# EAGLE design MySensors_AirQuality_Board_2017-11-26_i2c (EAGLE 8.3.2)
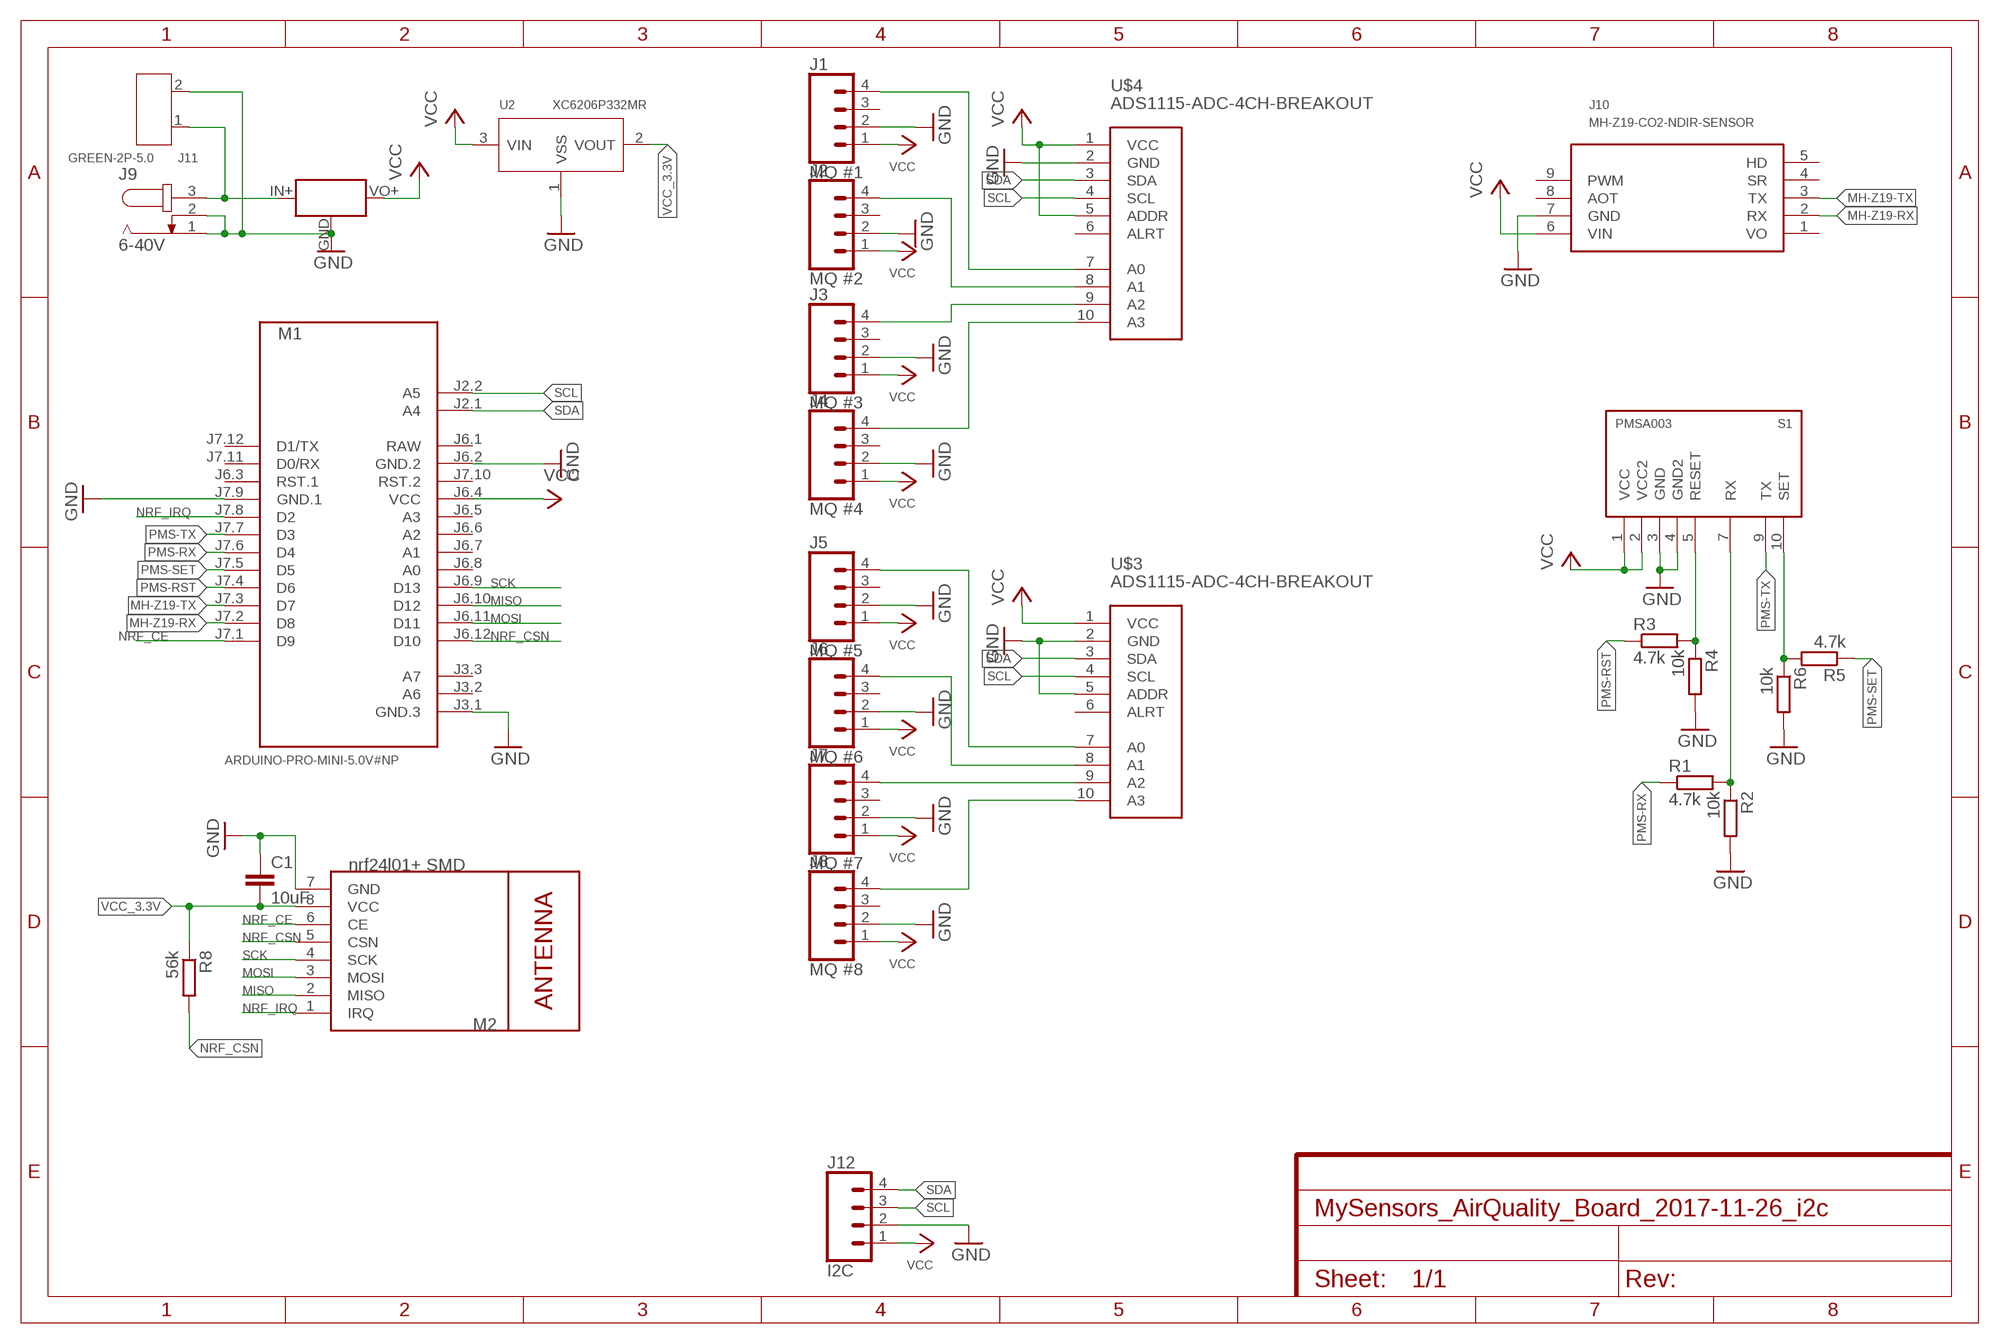
[diagram p0: schematic, sheet 1]
FRAME1 (FRAME-A4L): CNAME: MySensors AirQuality Board; CREVISION: 0.01; DESIGNER: R. Kainhofer, 2017-11-03

## Parts
C1  10uF  C-EUC0805  [C0805]
J1  MQ #1  CONN_04  [1X04]
J2  MQ #2  CONN_04  [1X04]
J3  MQ #3  CONN_04  [1X04]
J4  MQ #4  CONN_04  [1X04]
J5  MQ #5  CONN_04  [1X04]
J6  MQ #6  CONN_04  [1X04]
J7  MQ #7  CONN_04  [1X04]
J8  MQ #8  CONN_04  [1X04]
J9  6-40V  JACK-PLUG1  [SPC4078]
J10  MH-Z19-CO2-NDIR-SENSOR  [MH-Z19]
J11  GREEN-2P-5.0  SCREW-TERMINAL-GREEN(2P-5.0)  [H2-5.0-10.5X8.0MM]
J12  I2C  CONN_04  [1X04]
M1  ARDUINO-PRO-MINI-5.0V#NP  [ARDUINO-PRO-MINI#NP]
M2  nrf24l01+ SMD  WIRELESS-NRF24L01SMD  [WIRELESS-NRF24L01-SMD]
R1  4.7k  R-EU_R0805  [R0805]
R2  10k  R-EU_R0805  [R0805]
R3  4.7k  R-EU_R0805  [R0805]
R4  10k  R-EU_R0805  [R0805]
R5  4.7k  R-EU_R0805  [R0805]
R6  10k  R-EU_R0805  [R0805]
R8  56k  R-EU_R0805  [R0805]
S1  PMSA003  [PMSA003]
U2  XC6206P332MR  PMIC-LDO-XC6206P332MR-G(SOT23)  [SOT-23]
U$2  MINI_BUCK_CONVERTER  [MINI_BUCK_CONVERTER]
U$3  ADS1115-ADC-4CH-BREAKOUT  [ADS1115-ADC-4CH-BREAKOUT]
U$4  ADS1115-ADC-4CH-BREAKOUT  [ADS1115-ADC-4CH-BREAKOUT]

## Nets
A0: J1.4 U$4.7(A0)
A1: J2.4 U$4.8(A1)
A2: J3.4 U$4.9(A2)
A3: J4.4 U$4.10(A3)
GND: C1.1 J1.2 J2.2 J3.2 J4.2 J5.2 J6.2 J7.2 J8.2 J9.1 J9.2 J10.7(GND) J11.2 J12.2 M1.J3.1(GND.3) M1.J6.2(GND.2) M1.J7.9(GND.1) M2.7(GND) R2.2 R4.2 R6.2 S1.3(GND) S1.4(GND2) U2.1(VSS) U$2.GND U$3.2(GND) U$3.5(ADDR) U$4.2(GND)
MH-Z19-RX: J10.2(RX) M1.J7.2(D8)
MH-Z19-TX: J10.3(TX) M1.J7.3(D7)
MISO: M1.J6.10(D12) M2.2(MISO)
MOSI: M1.J6.11(D11) M2.3(MOSI)
N$1: J5.4 U$3.7(A0)
N$2: J9.3 J11.1 U$2.IN+(VIN)
N$3: J6.4 U$3.8(A1)
N$4: J7.4 U$3.9(A2)
N$5: J8.4 U$3.10(A3)
NRF_CE: M1.J7.1(D9) M2.6(CE)
NRF_CSN: M1.J6.12(D10) M2.5(CSN) R8.2
NRF_IRQ: M1.J7.8(D2) M2.1(IRQ)
PMS-RESET-3.3V: R3.2 R4.1 S1.5(RESET)
PMS-RST: M1.J7.4(D6) R3.1
PMS-RX: M1.J7.6(D4) R1.1
PMS-RX-3.3V: R1.2 R2.1 S1.7(RX)
PMS-SET: M1.J7.5(D5) R5.1
PMS-SET_3.3V: R5.2 R6.1 S1.10(SET)
PMS-TX: M1.J7.7(D3) S1.9(TX)
SCK: M1.J6.9(D13) M2.4(SCK)
SCL: J12.3 M1.J2.2(A5) U$3.4(SCL) U$4.4(SCL)
SDA: J12.4 M1.J2.1(A4) U$3.3(SDA) U$4.3(SDA)
VCC: J1.1 J2.1 J3.1 J4.1 J5.1 J6.1 J7.1 J8.1 J10.6(VIN) J12.1 M1.J6.4(VCC) S1.1(VCC) S1.2(VCC2) U2.3(VIN) U$2.VO+(VOUT) U$3.1(VCC) U$4.1(VCC) U$4.5(ADDR)
VCC_3.3V: C1.2 M2.8(VCC) R8.1 U2.2(VOUT)
Unconnected: J1.3 J2.3 J3.3 J4.3 J5.3 J6.3 J7.3 J8.3 J10.4(SR) J10.5(HD) J10.8(AOT) J10.9(PWM) M1.J3.2(A6) M1.J3.3(A7) M1.J6.3(RST.1) M1.J6.5(A3) M1.J6.6(A2) M1.J6.7(A1) M1.J6.8(A0) M1.J7.10(RST.2) M1.J7.11(D0/RX) M1.J7.12(D1/TX) U$3.6(ALRT) U$4.6(ALRT)

## Power pins joined to a net without a drawn wire
RAW: M1.J6.1(RAW)
VO: J10.1(VO)

## Library data of the parts
C1 = rcl:C-EU: CAPACITOR, European symbol
J1-J8 J12 = SparkFun-Connectors:CONN_04: Multi connection point. Often used as Generic Header-pin footprint for 0.1 inch spaced/style header connections On any of the 0.1 inch spaced packages, you can populate with these: Break Away Headers - Straight <https://www.sparkfun.com/products/116> (PRT-00116) Break Away Male Headers - Right Angle <https://www.sparkfun.com/products/553> (PRT-00553) Female Headers <https://www.sparkfun.com/products/115> (PRT-00115) Break Away Headers - Machine Pin <https://www.sparkfun.com/products/117> (PRT-00117) Break Away Female Headers - Swiss Machine Pin <https://www.sparkfun.com/products/743> (PRT-00743) For SCREWTERMINALS and SPRING TERMINALS visit here: Screw Terimnals on SparkFun.com <https://www.sparkfun.com/search/results?term=Screw+Terminals> (5mm/3.5mm/2.54mm spacing) This device is also useful as a general connection point to wire up your design to another part of your project. Our various solder wires solder well into these plated through hole pads. Hook-Up Wire - Assortment (Stranded, 22 AWG) <https://www.sparkfun.com/products/11375> (PRT-11375) Hook-Up Wire - Assortment (Solid Core, 22 AWG) <https://www.sparkfun.com/products/11367> (PRT-11367) View the entire wire category on our website here <https://www.sparkfun.com/categories/141> Special notes: Molex polarized connector foot print use with SKU : PRT-08231 with associated crimp pins and housings. 1MM SMD Version SKU: PRT-10208; PROD_ID: CONN-09696
J9 = con-jack:JACK-PLUG: DC POWER JACK Power Jack, DC, Right Angle, Through Hole, Rated 5A at 16VDC, PC Terminals Distributor: Farnell (www.Farnell.de) Drawing: 84N1161.pdf / 84N1162.pdf Manufacturer: SPC Technology (www.spctechnology.com) Type: SPC4077 / SPC 4078; OC_FARNELL: unknown; OC_NEWARK: unknown
J10 = opentools:MH-Z19: MH-Z19 - CO2 NDIR SENSOR
J11 = Seeed-Connector:SCREW-TERMINAL-GREEN(2P-5.0): 320110031
M1 = diy-modules:ARDUINO-PRO-MINI-*#NP: Arduino Pro Mini (and compatible devices) without programming pads More details available here: https://www.arduino.cc/en/Main/ArduinoBoardProMini Click here to find device on ebay.com <http://www.ebay.com/sch/arduino+pro+mini>
M2 = nrf24l01plus:WIRELESS-NRF24L01: 2.4 GHz Wireless Module based on NRF24L01 chip
R1-R6 = resistor:R-EU_: RESISTOR, European symbol
R8 = rcl:R-EU_: RESISTOR, European symbol
S1 = opentools:PMS: PLANTOWER PMSx003 Laser PM2.5 Dust Sensor
U2 = Seeed-IC:PMIC-LDO-XC6206P332MR-G(SOT23): 310030099; MPN: XC6206P332MR-G; VALUE: XC6206P332MR-G-SOT23
U$2 = opentools-sensors:MINI_BUCK_CONVERTER: 4.5-40V Step Down Buck Converter
U$3 U$4 = opentools:ADS1115-ADC-4CH-BREAKOUT: 4 Channel 16-Bit Analog-to-Digital Converter based on ADS1115 chip Arduino ADS1115 Getting Started Tutorial is available here: http://henrysbench.capnfatz.com/henrys-bench/arduino-voltage-measurements/arduino-ads1115-module-getting-started-tutorial/ ADS1115 datasheet is available here: http://www.ti.com/lit/ds/symlink/ads1115.pdf Click here to find device on ebay.com <http://www.ebay.com/sch/ads1115+module>

## Net classes
0 default: width 0.305 mm, clearance 0.203 mm

## Board
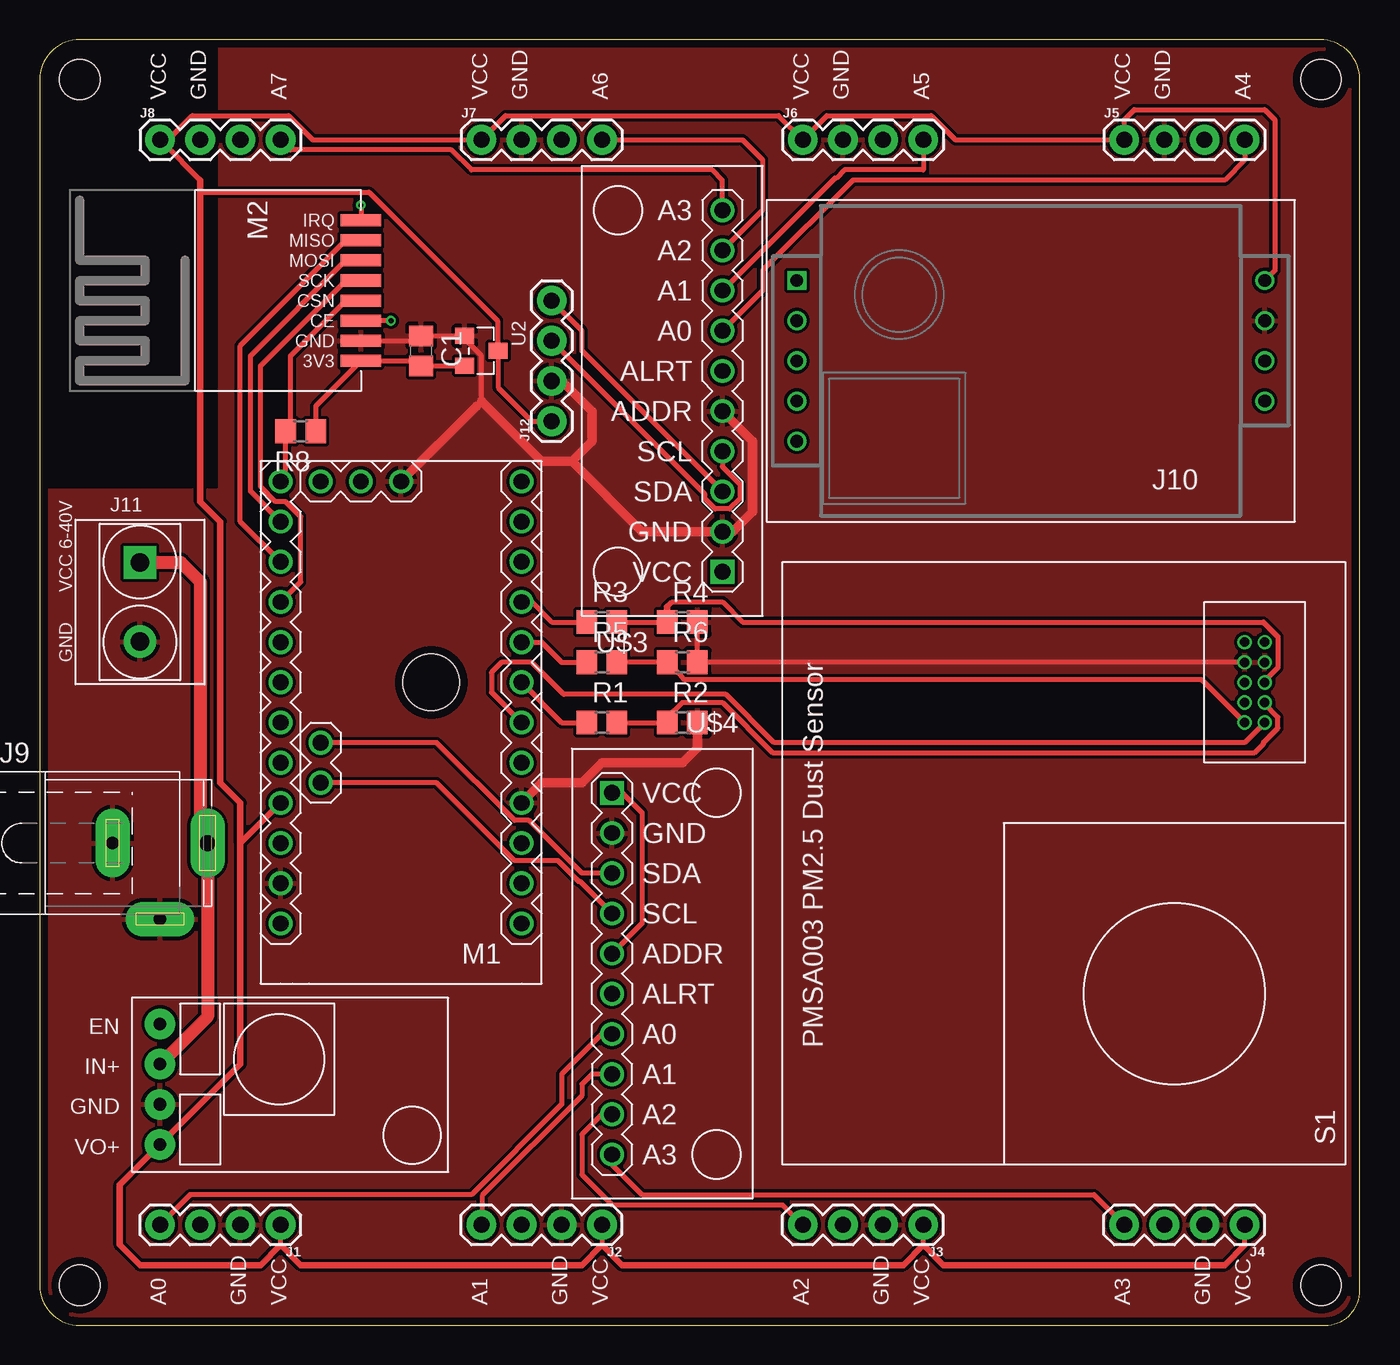
[diagram p1: board, top side]
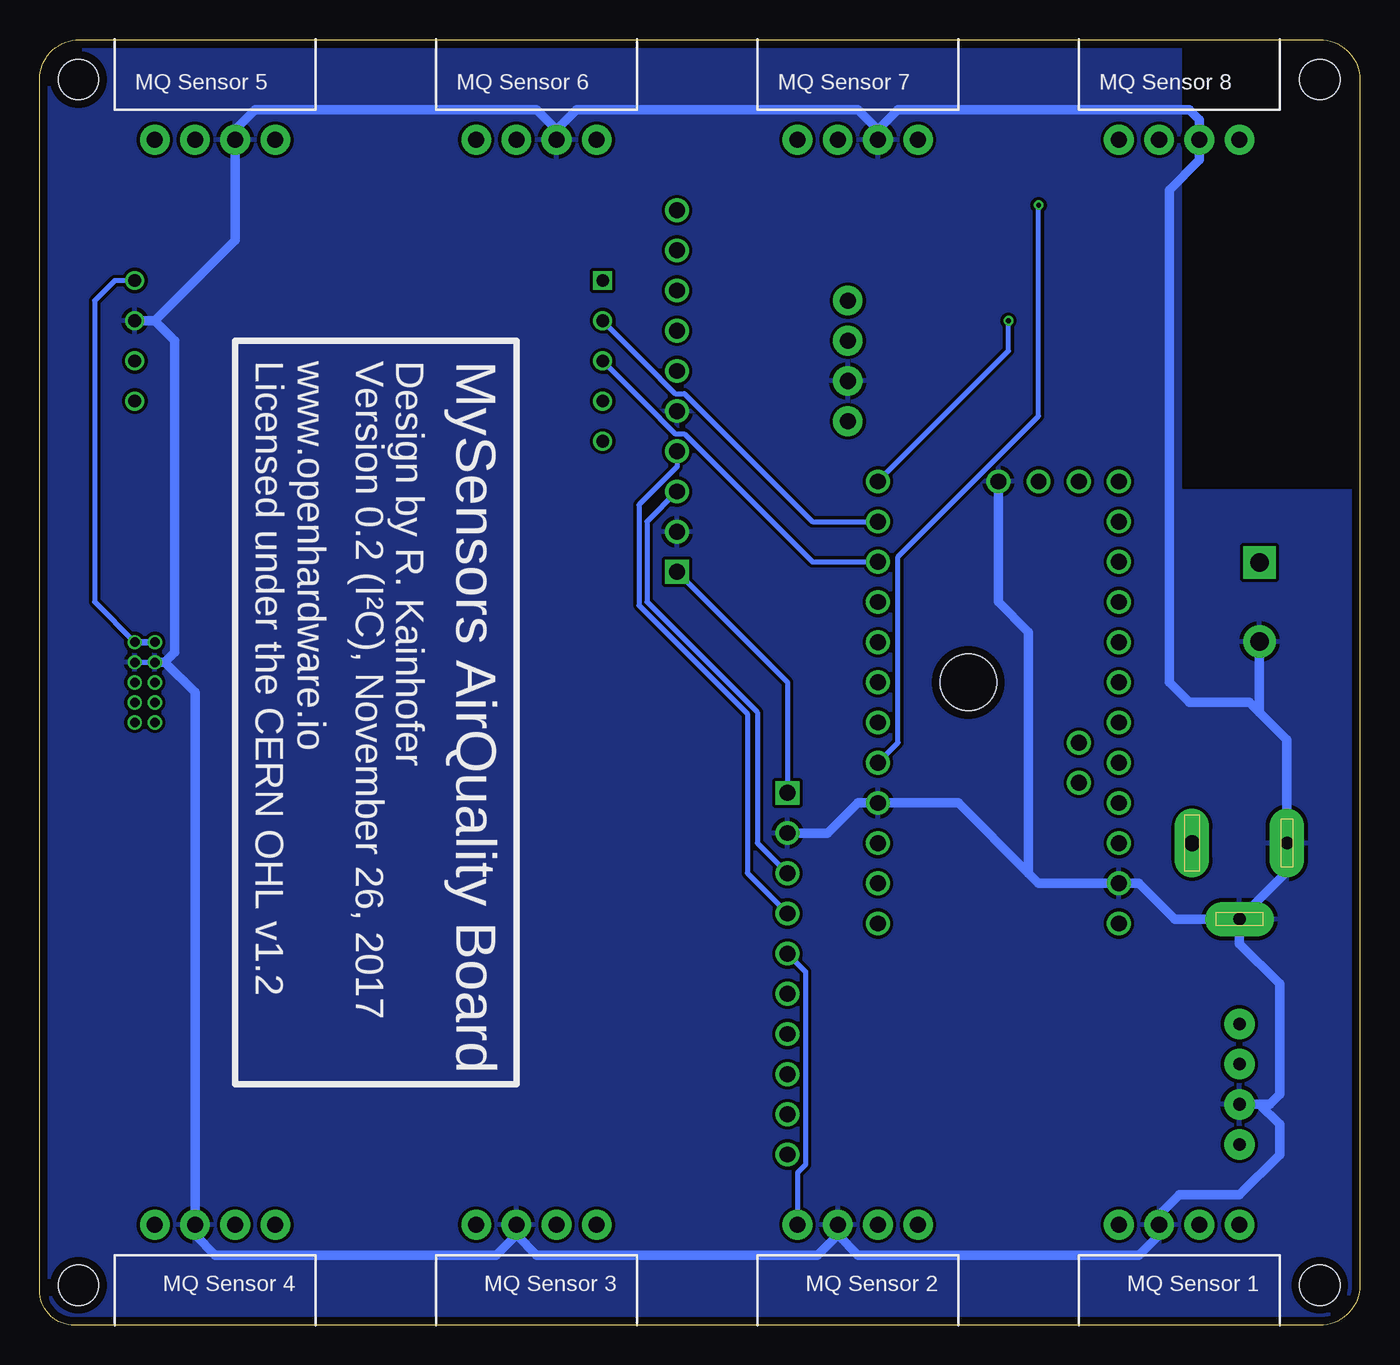
[diagram p2: board, bottom side, seen from below]

Size 83.49 x 81.27 mm. Coordinates in mm from the lower left corner, seen from the top.
Outline: 0,78.73 0,2.54 arc90 2.54,0 81.28,0 arc90 83.49,2.21 83.49,78.74 arc90 80.96,81.27 2.54,81.27 arc90 0,78.73
Copper layers (1*16): Top 0.035mm / dielectric 1.6mm / Bottom 0.035mm
Design rules "Elecrow_2-layer_PCB_eagle_rule": minimum track width 6mil, minimum drill 12mil, track to track 6mil, track to pad 6mil, pad to pad 6mil, via to via 8mil, smd to smd 0mil, copper to edge 20mil, drill to drill 10mil, minimum pad ring 6mil, minimum via ring 6mil, stop-mask expansion 0mil, vias tented up to drill 100mil, thermal gap 10mil
Holes 2.54 mm at 2.54,78.74 2.54,2.54 81.03,2.54 81.03,78.74
Holes 3.56 mm at 24.77,40.64

### Footprints (pad centres in the part's own frame; a part is rotated, then mirrored left to right if it is on the bottom)
C0805 = smd 1.3 x 1.5: 1 -0.95,0; 2 0.95,0
1X04 = drill 1.016 pad 1.88: 1 0,0; 2 2.54,0; 3 5.08,0; 4 7.62,0
SPC4078 = drill 0.8 pad 2.184 long: 1 -3,0; 2 0,-4.8 | drill 1 pad 2.184 long: 3 3,0
MH-Z19 = drill 0.8 square: 1 29.591,0 | drill 0.8: 2 29.591,2.54; 3 29.591,5.08; 4 29.591,7.62; 5 29.591,10.16; 6 0,0; 7 0,2.54; 8 0,5.08; 9 0,7.62
H2-5.0-10.5X8.0MM = drill 1.168 pad 2.032 square: 1 0,2.5 | drill 1.168 pad 2.032: 2 0,-2.5
ARDUINO-PRO-MINI#NP = drill 1: J2.1 -1.27,5.08; J2.2 -3.81,5.08; J3.1 15.24,0; J3.2 15.24,2.54; J3.3 15.24,5.08; J6.1 -12.7,7.62; J6.2 -10.16,7.62; J6.3 -7.62,7.62; J6.4 -5.08,7.62; J6.5 -2.54,7.62; J6.6 0,7.62; J6.7 2.54,7.62; J6.8 5.08,7.62; J6.9 7.62,7.62; J6.10 10.16,7.62; J6.11 12.7,7.62; J6.12 15.24,7.62; J7.1 15.24,-7.62; J7.2 12.7,-7.62; J7.3 10.16,-7.62; J7.4 7.62,-7.62; J7.5 5.08,-7.62; J7.6 2.54,-7.62; J7.7 0,-7.62; J7.8 -2.54,-7.62; J7.9 -5.08,-7.62; J7.10 -7.62,-7.62; J7.11 -10.16,-7.62; J7.12 -12.7,-7.62
WIRELESS-NRF24L01-SMD = smd 2.54 x 0.762: 1 1.27,0; 2 1.27,1.27; 3 1.27,2.54; 4 1.27,3.81; 5 1.27,5.08; 6 1.27,6.35; 7 1.27,7.62; 8 1.27,8.89
R0805 = smd 1.3 x 1.5: 1 -0.95,0; 2 0.95,0
PMSA003 = drill 0.6: 1 5.08,-5.08; 2 5.08,-6.35; 3 6.35,-5.08; 4 6.35,-6.35; 5 7.62,-5.08; 6 7.62,-6.35; 7 8.89,-5.08; 8 8.89,-6.35; 9 10.16,-5.08; 10 10.16,-6.35
SOT-23 = smd 1.016 x 1.2: 1 -0.95,-1.06; 2 0.95,-1.06; 3 0,1.06
MINI_BUCK_CONVERTER = drill 0.8 pad 1.93: EN 1.27,1.27; GND 6.35,1.27; IN+ 3.81,1.27; VO+ 8.89,1.27
ADS1115-ADC-4CH-BREAKOUT = drill 1 square: 1 -6.35,11.43 | drill 1: 2 -6.35,8.89; 3 -6.35,6.35; 4 -6.35,3.81; 5 -6.35,1.27; 6 -6.35,-1.27; 7 -6.35,-3.81; 8 -6.35,-6.35; 9 -6.35,-8.89; 10 -6.35,-11.43

### Placement (x,y rotation side)
C1  24.13,61.6 270 top
J1  15.24,6.35 180 top
J2  35.56,6.35 180 top
J3  55.88,6.35 180 top
J4  76.2,6.35 180 top
J5  68.58,74.93 0 top
J6  48.26,74.93 0 top
J7  27.94,74.93 0 top
J8  7.62,74.93 0 top
J9  7.62,30.48 0 top
J10  77.47,66.04 180 top
J11  6.35,45.72 0 top
J12  32.38,57.15 90 top
M1  22.86,38.1 90 top
M2  21.59,69.85 180 top
R1  35.56,38.1 0 top
R2  40.64,38.1 0 top
R3  35.56,44.45 0 top
R4  40.64,44.45 0 top
R5  35.56,41.91 0 top
R6  40.64,41.91 0 top
R8  16.51,56.52 180 top
S1  82.55,48.26 270 top
U2  27.94,61.6 270 top
U$2  6.35,20.32 270 top
U$3  36.83,59.05 180 top
U$4  42.55,22.22 0 top

### Tracks (layer width: path | path; a pad name or v marks a point on that pad's centre or on a via)
A0
  Top 0.305: U$4.7 35.56,18.41 33.02,15.88 33.02,13.97 27.3,8.26 9.53,8.26 J1.4
A1
  Top 0.305: U$4.8 34.92,15.88 34.29,15.24 34.29,14.52 27.98,8.21 27.98,6.39 J2.4
A2
  Top 0.305: U$4.9 35.56,13.33 34.29,12.06 34.29,9.53 36.2,7.62 46.99,7.62 J3.4
A3
  Top 0.305: U$4.10 36.2,10.16 38.1,8.26 66.67,8.26 J4.4
GND
  Top 0.305: R4.2 R6.2 S1.4 | J6.2 50.8,74.3 | M2.7 24.13,62.23 C1.1 26.67,62.55 U2.1 26.99,62.23 27.94,61.28 27.94,58.42 27.62,58.1
  Top 0.61: U$3.5 45.09,55.88 45.09,51.44 43.81,50.17 U$3.2 38.1,50.17 33.66,54.61 | J12.2 33.02,59.69 34.92,57.79 34.92,55.88 33.66,54.61 | 33.66,54.61 31.75,54.61 27.94,58.42 | 27.62,58.1 M1.J3.1 | R2.2 41.59,36.51 40.64,35.56 35.56,35.56 34.29,34.29 31.75,34.29 M1.J7.9
  Bottom 0.305: S1.3 S1.4
  Bottom 0.406: 7.9,25.4 J9.2
  Bottom 0.61: 30.48,75.56 31.75,76.83 49.53,76.83 50.8,75.56 | J7.2 30.48,75.56 | 30.48,75.56 29.21,76.83 10.79,76.83 10.16,76.2 J8.2 10.16,73.66 12.06,71.75 12.06,40.64 10.79,39.37 6.99,39.37 6.35,38.74 | J6.2 50.8,75.56 | 50.8,75.56 52.07,76.83 69.85,76.83 71.12,75.56 J5.2 71.12,68.58 76.2,63.5 | 76.2,63.5 J10.7 | 6.35,38.74 J11.2 | 6.35,38.74 4.62,37.01 J9.1 4.62,28.68 J9.2 11.71,25.68 13.97,27.94 M1.J6.2 20.32,27.94 20.95,28.57 | U$4.2 33.66,31.11 31.75,33.02 M1.J7.9 25.4,33.02 20.95,28.57 | 33.02,5.71 31.75,4.45 13.97,4.45 12.7,5.71 J1.2 12.7,6.98 11.43,8.26 7.62,8.26 5.08,10.79 5.08,12.7 6.35,13.97 | 33.02,5.71 J2.2 | 33.02,5.71 34.29,4.45 52.07,4.45 53.34,5.71 | J3.2 53.34,5.71 | 53.34,5.71 54.61,4.45 72.39,4.45 73.66,5.71 J4.2 73.66,40.01 75.56,41.91 | 6.35,13.97 U$2.GND | 6.35,13.97 5.71,13.97 5.08,14.61 5.08,21.59 7.62,24.13 7.62,25.12 7.9,25.4 | M1.J3.1 22.86,45.72 20.95,43.82 20.95,28.57 | 75.56,41.91 74.93,42.55 74.93,62.23 76.2,63.5 | S1.4 75.56,41.91
  pour Bottom: 0,0 83.82,0 83.82,81.28 11.43,81.28 11.43,52.71 0,52.71
  pour Top: 0,0 83.82,0 83.82,81.28 11.43,81.28 11.43,52.71 0,52.71
MH-Z19-RX
  Bottom 0.305: J10.2 44.29,59.91 44.29,59.87 43.31,58.89 42.72,58.89 34.63,50.8 M1.J7.2
MH-Z19-TX
  Bottom 0.305: J10.3 44.29,57.37 44.29,57.33 43.31,56.35 42.72,56.35 34.63,48.26 M1.J7.3
MISO
  Top 0.305: M2.2 19.37,68.58 12.7,61.91 12.7,50.8 M1.J6.10
MOSI
  Top 0.305: M2.3 19.37,67.31 13.34,61.28 13.34,52.71 M1.J6.11
N$1
  Top 0.305: J5.4 76.2,73.66 74.93,72.39 51.44,72.39 45.72,66.67 45.72,65.41 U$3.7
N$2
  Top 0.813: J11.1 8.93,48.22 10.16,46.99 10.16,30.94 J9.3 10.62,19.51 U$2.IN+
N$3
  Top 0.305: J6.4 55.88,73.02 50.88,73.02 50.38,72.52 50.29,72.52 U$3.8
N$4
  Top 0.305: 35.56,74.52 J7.4 44.45,74.93 45.72,73.66 45.72,70.48 U$3.9
N$5
  Top 0.305: U$3.10 43.18,72.39 42.55,73.02 27.3,73.02 26.04,74.3 15.88,74.3 J8.4
NRF_CE  (via drill 0.3)
  Top 0.305: v22.23,63.5 M2.6
  Bottom 0.305: v22.23,63.5 22.23,61.6 M1.J7.1
NRF_CSN
  Top 0.305: M1.J6.12 15.56,53.66 R8.2 15.88,56.52 15.88,61.28 19.37,64.77 M2.5
NRF_IRQ  (via drill 0.3)
  Top 0.305: v20.32,70.8 M2.1
  Bottom 0.305: v20.32,70.8 20.32,57.47 29.21,48.58 29.21,36.83 M1.J7.8
PMS-RESET-3.3V
  Top 0.305: R3.2 R4.1 | 39.69,45.41 40.01,45.72 43.18,45.72 44.45,44.45 77.38,44.45 78.3,43.53 78.3,41.57 77.47,40.73 S1.5
  Top 0.406: R4.1 39.69,45.41
PMS-RST
  Top 0.305: M1.J7.4 31.11,45.72 32.38,44.45 R3.1
PMS-RX
  Top 0.305: M1.J7.6 33.02,38.1 R1.1
PMS-RX-3.3V
  Top 0.305: R1.2 R2.1 39.8,38.1 | S1.7 77.47,39.28 78.3,38.45 78.3,37.76 77.38,36.83 77.38,36.74 76.83,36.2 46.35,36.2 43.18,39.37 40.64,39.37 39.69,38.42
  Top 0.406: R2.1 39.69,38.42
PMS-SET
  Top 0.305: M1.J7.5 31.75,43.18 33.02,41.91 R5.1
PMS-SET_3.3V
  Top 0.305: R6.1 R5.2 | R6.1 39.8,41.91 | R6.1 40.58,41.02 40.58,41.01 40.79,40.8 73.5,40.8 S1.10
PMS-TX
  Top 0.305: S1.9 76.2,36.83 46.44,36.83 43.39,39.88 33.15,39.88 31.11,41.91 29.21,41.91 28.57,41.28 28.57,40.01 M1.J7.7
SCK
  Top 0.305: M2.4 19.37,66.04 13.97,60.64 13.97,53.02 14.92,52.07 15.56,52.07 16.51,51.12 16.51,46.99 M1.J6.9
SCL
  Top 0.305: U$3.4 43.18,54.27 44.29,53.16 44.29,52.25 43.64,51.6 42.72,51.6 42.07,52.25 42.07,52.54 J12.3 | U$4.4 34.16,28.07 34.08,28.07 32.77,29.37 30.02,29.37 25.11,34.29 M1.J2.2
  Bottom 0.305: U$3.4 43.18,54.27 45.59,51.86 45.59,45.51 38.73,38.65 38.73,28.57 U$4.4
SDA
  Top 0.305: U$3.3 34.29,61.6 34.29,62.87 J12.4 | J12.4 32.38,65.41 J12.4 | U$4.3 34.29,28.57 30.95,31.91 30.02,31.91 25.11,36.83 M1.J2.1
  Bottom 0.305: U$3.3 45.09,50.8 45.09,45.72 38.1,38.74 38.1,30.48 U$4.3
VCC
  Top 0.305: 15.24,5.08 J1.1 | J2.1 35.56,5.08 | 55.88,5.08 J3.1 | 10.16,72.39 7.87,74.68 | 76.2,5.08 J4.1 | 7.87,74.68 9.65,76.45 15.75,76.45 17.27,74.93 J7.1 29.46,76.45 46.74,76.45 J6.1 49.78,76.45 56.39,76.45 57.91,74.93 J5.1 68.58,76.2 69.22,76.83 77.47,76.83 78.11,76.2 78.11,66.67 J10.6 | 7.87,74.68 J8.1 | 10.16,71.63 20.83,71.63 28.96,63.5 28.96,61.72 U2.3 29,59.27 31.11,57.15 J12.1 | U$4.1 36.83,33.66 38.1,32.38 38.1,25.4 U$4.5
  Top 0.406: M1.J6.4 12.7,30.48 | 12.7,30.48 12.7,16.51 U$2.VO+ 5.08,8.89 5.08,5.08 6.35,3.81 13.97,3.81 15.24,5.08 16.51,3.81 34.29,3.81 35.56,5.08 36.83,3.81 54.61,3.81 55.88,5.08 57.15,3.81 74.93,3.81 76.2,5.08 | 12.7,30.48 12.7,33.02 11.43,34.29 11.43,50.8 10.16,52.07 10.16,71.63 10.16,72.39
  Bottom 0.305: J10.6 78.74,66.04 80.01,64.77 80.01,45.72 S1.1 | J2.1 35.56,9.65 35.05,10.16 35.05,22.35 U$4.5 | U$3.1 36.2,40.64 U$4.1
  Bottom 0.406: S1.1 S1.2
VCC_3.3V
  Top 0.305: U2.2 26.67,60.64 C1.2 24.13,60.96 M2.8 17.46,58.1 R8.1

### Text on the board
tPlace: VCC / GND / / A7 | VCC / GND / / A6 | VCC / GND / / A5 | VCC / GND / / A4 | VCC 6-40V | GND | EN / IN+ / GND / VO+ | A0 / / GND / VCC | A1 / / GND / VCC | A2 / / GND / VCC | A3 / / GND / VCC
bPlace: MQ Sensor 8 | MQ Sensor 7 | MQ Sensor 6 | MQ Sensor 5 | MySensors AirQuality Board | Design by R. Kainhofer | Version 0.2 (I²C), November 26, 2017 | www.openhardware.io / Licensed under the CERN OHL v1.2 | MQ Sensor 1 | MQ Sensor 2 | MQ Sensor 3 | MQ Sensor 4